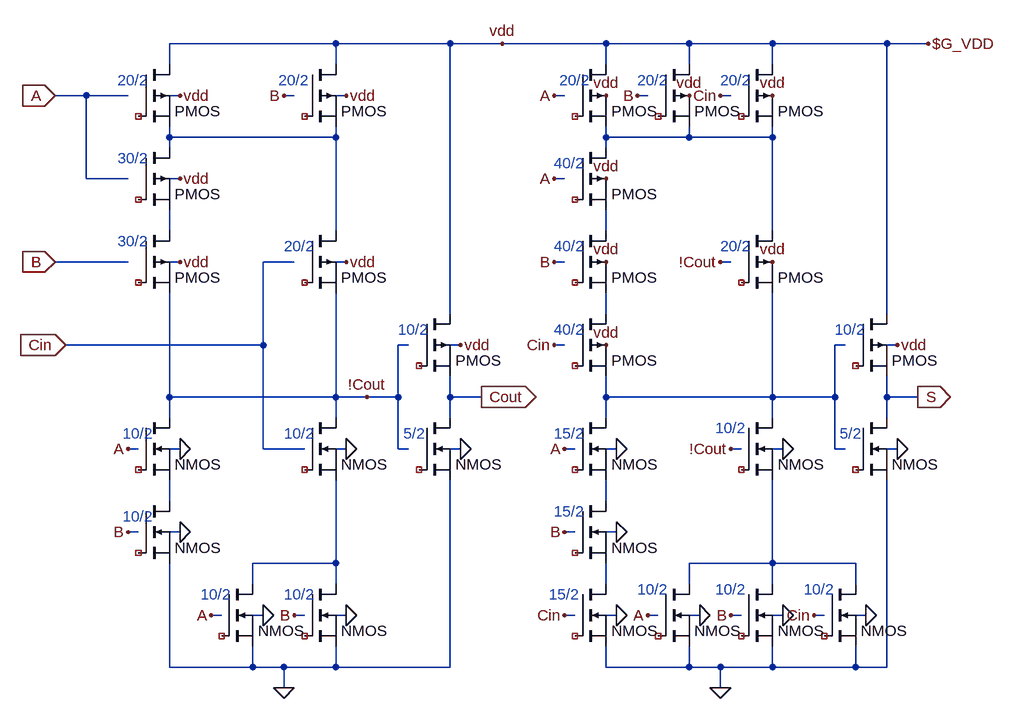
[diagram p0: schematic fa.asc]
fa.asc, the LTspice schematic file:
Version 4
SHEET 1 1208 1464
WIRE 176 -256 -80 -256
WIRE 352 -256 176 -256
WIRE 432 -256 352 -256
WIRE 592 -256 432 -256
WIRE 720 -256 592 -256
WIRE 848 -256 720 -256
WIRE 1024 -256 848 -256
WIRE 1088 -256 1024 -256
WIRE -80 -224 -80 -256
WIRE 176 -224 176 -256
WIRE 592 -224 592 -256
WIRE 720 -224 720 -256
WIRE 848 -224 848 -256
WIRE -208 -176 -256 -176
WIRE -144 -176 -208 -176
WIRE -64 -176 -80 -176
WIRE 112 -176 96 -176
WIRE 192 -176 176 -176
WIRE 528 -176 512 -176
WIRE 656 -176 640 -176
WIRE 784 -176 768 -176
WIRE -80 -112 -80 -128
WIRE 176 -112 176 -128
WIRE 176 -112 -80 -112
WIRE 592 -112 592 -128
WIRE 720 -112 720 -128
WIRE 720 -112 592 -112
WIRE 848 -112 848 -128
WIRE 848 -112 720 -112
WIRE -80 -96 -80 -112
WIRE 592 -96 592 -112
WIRE -208 -48 -208 -176
WIRE -144 -48 -208 -48
WIRE -64 -48 -80 -48
WIRE 528 -48 512 -48
WIRE -80 32 -80 0
WIRE 176 32 176 -112
WIRE 592 32 592 0
WIRE 848 32 848 -112
WIRE -144 80 -256 80
WIRE -64 80 -80 80
WIRE 112 80 64 80
WIRE 192 80 176 80
WIRE 528 80 512 80
WIRE 784 80 768 80
WIRE 352 160 352 -256
WIRE 592 160 592 128
WIRE 1024 160 1024 -256
WIRE 64 208 64 80
WIRE 64 208 -240 208
WIRE 288 208 272 208
WIRE 368 208 352 208
WIRE 528 208 512 208
WIRE 960 208 944 208
WIRE 1040 208 1024 208
WIRE -80 288 -80 128
WIRE 176 288 176 128
WIRE 176 288 -80 288
WIRE 224 288 176 288
WIRE 272 288 272 208
WIRE 272 288 224 288
WIRE 352 288 352 256
WIRE 400 288 352 288
WIRE 592 288 592 256
WIRE 848 288 848 128
WIRE 848 288 592 288
WIRE 944 288 944 208
WIRE 944 288 848 288
WIRE 1024 288 1024 256
WIRE 1072 288 1024 288
WIRE -80 320 -80 288
WIRE 176 320 176 288
WIRE 352 320 352 288
WIRE 592 320 592 288
WIRE 848 320 848 288
WIRE 1024 320 1024 288
WIRE -128 368 -144 368
WIRE -64 368 -80 368
WIRE 64 368 64 208
WIRE 112 368 64 368
WIRE 128 368 112 368
WIRE 192 368 176 368
WIRE 272 368 272 288
WIRE 288 368 272 368
WIRE 368 368 352 368
WIRE 544 368 528 368
WIRE 608 368 592 368
WIRE 800 368 784 368
WIRE 864 368 848 368
WIRE 944 368 944 288
WIRE 960 368 944 368
WIRE 1040 368 1024 368
WIRE -80 448 -80 416
WIRE 592 448 592 416
WIRE -128 496 -144 496
WIRE -64 496 -80 496
WIRE 544 496 528 496
WIRE 608 496 592 496
WIRE 176 544 176 416
WIRE 176 544 48 544
WIRE 848 544 848 416
WIRE 848 544 720 544
WIRE 976 544 848 544
WIRE 48 576 48 544
WIRE 176 576 176 544
WIRE 592 576 592 544
WIRE 720 576 720 544
WIRE 848 576 848 544
WIRE 976 576 976 544
WIRE 0 624 -16 624
WIRE 64 624 48 624
WIRE 128 624 112 624
WIRE 192 624 176 624
WIRE 544 624 528 624
WIRE 608 624 592 624
WIRE 672 624 656 624
WIRE 736 624 720 624
WIRE 800 624 784 624
WIRE 864 624 848 624
WIRE 928 624 912 624
WIRE 992 624 976 624
WIRE -80 704 -80 544
WIRE 48 704 48 672
WIRE 48 704 -80 704
WIRE 96 704 48 704
WIRE 176 704 176 672
WIRE 176 704 96 704
WIRE 352 704 352 416
WIRE 352 704 176 704
WIRE 592 704 592 672
WIRE 720 704 720 672
WIRE 720 704 592 704
WIRE 768 704 720 704
WIRE 848 704 848 672
WIRE 848 704 768 704
WIRE 976 704 976 672
WIRE 976 704 848 704
WIRE 1024 704 1024 416
WIRE 1024 704 976 704
WIRE 96 736 96 704
WIRE 768 736 768 704
FLAG 528 368 A
FLAG 528 496 B
FLAG 528 624 Cin
FLAG 784 368 !Cout
FLAG 656 624 A
FLAG 784 624 B
FLAG 912 624 Cin
FLAG 768 736 0
FLAG 512 -48 A
FLAG 512 80 B
FLAG 512 208 Cin
FLAG 768 80 !Cout
FLAG 512 -176 A
FLAG 640 -176 B
FLAG 768 -176 Cin
FLAG 1072 288 S
IOPIN 1072 288 Out
FLAG 1088 -256 $G_VDD
FLAG -144 368 A
FLAG -144 496 B
FLAG -16 624 A
FLAG 112 624 B
FLAG 96 736 0
FLAG -256 80 B
IOPIN -256 80 In
FLAG -240 208 Cin
IOPIN -240 208 In
FLAG -256 -176 A
IOPIN -256 -176 In
FLAG 96 -176 B
FLAG 400 288 Cout
IOPIN 400 288 Out
FLAG 224 288 !Cout
FLAG -64 368 0
FLAG -64 496 0
FLAG 64 624 0
FLAG 192 624 0
FLAG 192 368 0
FLAG 368 368 0
FLAG 608 368 0
FLAG 608 496 0
FLAG 608 624 0
FLAG 736 624 0
FLAG 864 624 0
FLAG 992 624 0
FLAG 864 368 0
FLAG 1040 368 0
FLAG 432 -256 vdd
FLAG -64 -176 vdd
FLAG -64 -48 vdd
FLAG -64 80 vdd
FLAG 192 -176 vdd
FLAG 192 80 vdd
FLAG 368 208 vdd
FLAG 592 -48 vdd
FLAG 592 80 vdd
FLAG 592 208 vdd
FLAG 848 80 vdd
FLAG 1040 208 vdd
FLAG 848 -176 vdd
FLAG 592 -176 vdd
FLAG 720 -176 vdd
SYMBOL NMOS 544 320 R0
WINDOW 0 56 32 Invisible 2
SYMATTR InstName M1
SYMATTR Value2 l=0.6u w=4.5u
SYMATTR SpiceModel ""
SYMATTR Value NMOS
SYMBOL NMOS 544 448 R0
WINDOW 0 56 32 Invisible 2
SYMATTR InstName M3
SYMATTR Value2 l=0.6u w=4.5u
SYMATTR SpiceModel ""
SYMATTR Value NMOS
SYMBOL NMOS 544 576 R0
WINDOW 0 56 32 Invisible 2
SYMATTR InstName M4
SYMATTR Value2 l=0.6u w=4.5u
SYMATTR SpiceModel ""
SYMATTR Value NMOS
SYMBOL NMOS 672 576 R0
WINDOW 0 56 32 Invisible 2
SYMATTR InstName M5
SYMATTR Value2 l=0.6u w=3u
SYMATTR SpiceModel ""
SYMATTR Value NMOS
SYMBOL NMOS 800 576 R0
WINDOW 0 56 32 Invisible 2
SYMATTR InstName M6
SYMATTR Value2 l=0.6u w=3u
SYMATTR SpiceModel ""
SYMATTR Value NMOS
SYMBOL NMOS 928 576 R0
WINDOW 0 56 32 Invisible 2
SYMATTR InstName M7
SYMATTR Value2 l=0.6u w=3u
SYMATTR SpiceModel ""
SYMATTR Value NMOS
SYMBOL NMOS 800 320 R0
WINDOW 0 56 32 Invisible 2
SYMATTR InstName M8
SYMATTR Value2 l=0.6u w=3u
SYMATTR SpiceModel ""
SYMATTR Value NMOS
SYMBOL PMOS 544 -96 R0
WINDOW 0 56 32 Invisible 2
SYMATTR InstName M10
SYMATTR Value2 l=0.6u w=12u
SYMATTR SpiceModel ""
SYMATTR Value PMOS
SYMBOL NMOS 976 320 R0
WINDOW 0 56 32 Invisible 2
SYMATTR InstName M15
SYMATTR Value NMOS
SYMATTR Value2 l=0.6u w=1.5u
SYMATTR SpiceModel ""
SYMBOL PMOS 976 160 R0
WINDOW 0 56 32 Invisible 2
SYMATTR InstName M16
SYMATTR Value PMOS
SYMATTR Value2 l=0.6u w=3u
SYMATTR SpiceModel ""
SYMBOL NMOS -128 320 R0
WINDOW 0 56 32 Invisible 2
SYMATTR InstName M17
SYMATTR Value NMOS
SYMATTR Value2 l=0.6u w=3u
SYMATTR SpiceModel ""
SYMBOL NMOS -128 448 R0
WINDOW 0 56 32 Invisible 2
SYMATTR InstName M19
SYMATTR Value NMOS
SYMATTR Value2 l=0.6u w=3u
SYMATTR SpiceModel ""
SYMBOL NMOS 0 576 R0
WINDOW 0 56 32 Invisible 2
SYMATTR InstName M21
SYMATTR Value NMOS
SYMATTR Value2 l=0.6u w=3u
SYMATTR SpiceModel ""
SYMBOL NMOS 128 576 R0
WINDOW 0 56 32 Invisible 2
SYMATTR InstName M22
SYMATTR Value NMOS
SYMATTR Value2 l=0.6u w=3u
SYMATTR SpiceModel ""
SYMBOL NMOS 128 320 R0
WINDOW 0 56 32 Invisible 2
SYMATTR InstName M24
SYMATTR Value NMOS
SYMATTR Value2 l=0.6u w=3u
SYMATTR SpiceModel ""
SYMBOL PMOS -128 32 R0
WINDOW 0 56 32 Invisible 2
SYMATTR InstName M25
SYMATTR Value PMOS
SYMATTR Value2 l=0.6u w=9u
SYMATTR SpiceModel ""
SYMBOL PMOS -128 -96 R0
WINDOW 0 56 32 Invisible 2
SYMATTR InstName M26
SYMATTR Value PMOS
SYMATTR Value2 l=0.6u w=9u
SYMATTR SpiceModel ""
SYMBOL PMOS 128 32 R0
WINDOW 0 56 32 Invisible 2
SYMATTR InstName M27
SYMATTR Value PMOS
SYMATTR Value2 l=0.6u w=6u
SYMATTR SpiceModel ""
SYMBOL PMOS -128 -224 R0
WINDOW 0 56 32 Invisible 2
SYMATTR InstName M28
SYMATTR Value PMOS
SYMATTR Value2 l=0.6u w=6u
SYMATTR SpiceModel ""
SYMBOL PMOS 128 -224 R0
WINDOW 0 56 32 Invisible 2
SYMATTR InstName M29
SYMATTR Value PMOS
SYMATTR Value2 l=0.6u w=6u
SYMATTR SpiceModel ""
SYMBOL NMOS 304 320 R0
WINDOW 0 56 32 Invisible 2
SYMATTR InstName M31
SYMATTR Value NMOS
SYMATTR Value2 l=0.6u w=1.5u
SYMATTR SpiceModel ""
SYMBOL PMOS 304 160 R0
WINDOW 0 56 32 Invisible 2
SYMATTR InstName M32
SYMATTR Value PMOS
SYMATTR Value2 l=0.6u w=3u
SYMATTR SpiceModel ""
SYMBOL PMOS 800 32 R0
WINDOW 0 56 32 Invisible 2
SYMATTR InstName M11
SYMATTR Value PMOS
SYMATTR Value2 l=0.6u w=6u
SYMATTR SpiceModel ""
SYMBOL PMOS 800 -224 R0
WINDOW 0 56 32 Invisible 2
SYMATTR InstName M13
SYMATTR Value PMOS
SYMATTR Value2 l=0.6u w=6u
SYMATTR SpiceModel ""
SYMBOL PMOS 672 -224 R0
WINDOW 0 56 32 Invisible 2
SYMATTR InstName M14
SYMATTR Value PMOS
SYMATTR Value2 l=0.6u w=6u
SYMATTR SpiceModel ""
SYMBOL PMOS 544 -224 R0
WINDOW 0 56 32 Invisible 2
SYMATTR InstName M12
SYMATTR Value PMOS
SYMATTR Value2 l=0.6u w=6u
SYMATTR SpiceModel ""
SYMBOL PMOS 544 32 R0
WINDOW 0 56 32 Invisible 2
SYMATTR InstName M2
SYMATTR Value2 l=0.6u w=12u
SYMATTR SpiceModel ""
SYMATTR Value PMOS
SYMBOL PMOS 544 160 R0
WINDOW 0 56 32 Invisible 2
SYMATTR InstName M9
SYMATTR Value2 l=0.6u w=12u
SYMATTR SpiceModel ""
SYMATTR Value PMOS
TEXT 88 -200 Left 2 ;20/2
TEXT 96 56 Left 2 ;20/2
TEXT 272 184 Left 2 ;10/2
TEXT 280 344 Left 2 ;5/2
TEXT 944 184 Left 2 ;10/2
TEXT 952 344 Left 2 ;5/2
TEXT -160 -200 Left 2 ;20/2
TEXT -160 -80 Left 2 ;30/2
TEXT -160 48 Left 2 ;30/2
TEXT 96 344 Left 2 ;10/2
TEXT -32 592 Left 2 ;10/2
TEXT 96 592 Left 2 ;10/2
TEXT -152 344 Left 2 ;10/2
TEXT -152 472 Left 2 ;10/2
TEXT 760 336 Left 2 ;10/2
TEXT 640 584 Left 2 ;10/2
TEXT 760 584 Left 2 ;10/2
TEXT 896 584 Left 2 ;10/2
TEXT 512 344 Left 2 ;15/2
TEXT 512 464 Left 2 ;15/2
TEXT 504 592 Left 2 ;15/2
TEXT 768 56 Left 2 ;20/2
TEXT 768 -200 Left 2 ;20/2
TEXT 640 -200 Left 2 ;20/2
TEXT 520 -200 Left 2 ;20/2
TEXT 512 -72 Left 2 ;40/2
TEXT 512 56 Left 2 ;40/2
TEXT 512 184 Left 2 ;40/2

The netlist it stands for:
* fa.asc
* M1: NMOS l=0.6u w=4.5u (symbol NMOS not certain, pin order unknown); nets seen at it: N006, N008
* M3: NMOS l=0.6u w=4.5u (symbol NMOS not certain, pin order unknown); nets seen at it: N008, N011
* M4: NMOS l=0.6u w=4.5u (symbol NMOS not certain, pin order unknown); nets seen at it: 0, N011
* M5: NMOS l=0.6u w=3u (symbol NMOS not certain, pin order unknown); nets seen at it: 0, N010
* M6: NMOS l=0.6u w=3u (symbol NMOS not certain, pin order unknown); nets seen at it: 0, N010
* M7: NMOS l=0.6u w=3u (symbol NMOS not certain, pin order unknown); nets seen at it: 0, N010
* M8: NMOS l=0.6u w=3u (symbol NMOS not certain, pin order unknown); nets seen at it: N006, N010
* M10: PMOS l=0.6u w=12u (symbol PMOS not certain, pin order unknown); nets seen at it: N002, N004
* M15: NMOS l=0.6u w=1.5u (symbol NMOS not certain, pin order unknown); nets seen at it: 0, S
* M16: PMOS l=0.6u w=3u (symbol PMOS not certain, pin order unknown); nets seen at it: S, vdd
* M17: NMOS l=0.6u w=3u (symbol NMOS not certain, pin order unknown); nets seen at it: !Cout, N007
* M19: NMOS l=0.6u w=3u (symbol NMOS not certain, pin order unknown); nets seen at it: 0, N007
* M21: NMOS l=0.6u w=3u (symbol NMOS not certain, pin order unknown); nets seen at it: 0, N009
* M22: NMOS l=0.6u w=3u (symbol NMOS not certain, pin order unknown); nets seen at it: 0, N009
* M24: NMOS l=0.6u w=3u (symbol NMOS not certain, pin order unknown); nets seen at it: !Cout, N009
* M25: PMOS l=0.6u w=9u (symbol PMOS not certain, pin order unknown); nets seen at it: !Cout, N003
* M26: PMOS l=0.6u w=9u (symbol PMOS not certain, pin order unknown); nets seen at it: N001, N003
* M27: PMOS l=0.6u w=6u (symbol PMOS not certain, pin order unknown); nets seen at it: !Cout, N001
* M28: PMOS l=0.6u w=6u (symbol PMOS not certain, pin order unknown); nets seen at it: N001, vdd
* M29: PMOS l=0.6u w=6u (symbol PMOS not certain, pin order unknown); nets seen at it: N001, vdd
* M31: NMOS l=0.6u w=1.5u (symbol NMOS not certain, pin order unknown); nets seen at it: 0, Cout
* M32: PMOS l=0.6u w=3u (symbol PMOS not certain, pin order unknown); nets seen at it: Cout, vdd
* M11: PMOS l=0.6u w=6u (symbol PMOS not certain, pin order unknown); nets seen at it: N002, N006
* M13: PMOS l=0.6u w=6u (symbol PMOS not certain, pin order unknown); nets seen at it: N002, vdd
* M14: PMOS l=0.6u w=6u (symbol PMOS not certain, pin order unknown); nets seen at it: N002, vdd
* M12: PMOS l=0.6u w=6u (symbol PMOS not certain, pin order unknown); nets seen at it: N002, vdd
* M2: PMOS l=0.6u w=12u (symbol PMOS not certain, pin order unknown); nets seen at it: N004, N005
* M9: PMOS l=0.6u w=12u (symbol PMOS not certain, pin order unknown); nets seen at it: N005, N006
* 20/2
* 20/2
* 10/2
* 5/2
* 10/2
* 5/2
* 20/2
* 30/2
* 30/2
* 10/2
* 10/2
* 10/2
* 10/2
* 10/2
* 10/2
* 10/2
* 10/2
* 10/2
* 15/2
* 15/2
* 15/2
* 20/2
* 20/2
* 20/2
* 20/2
* 40/2
* 40/2
* 40/2
.backanno
.end